# EAGLE schematic dash (EAGLE 9.6.2)

## Sheet 1 of 2
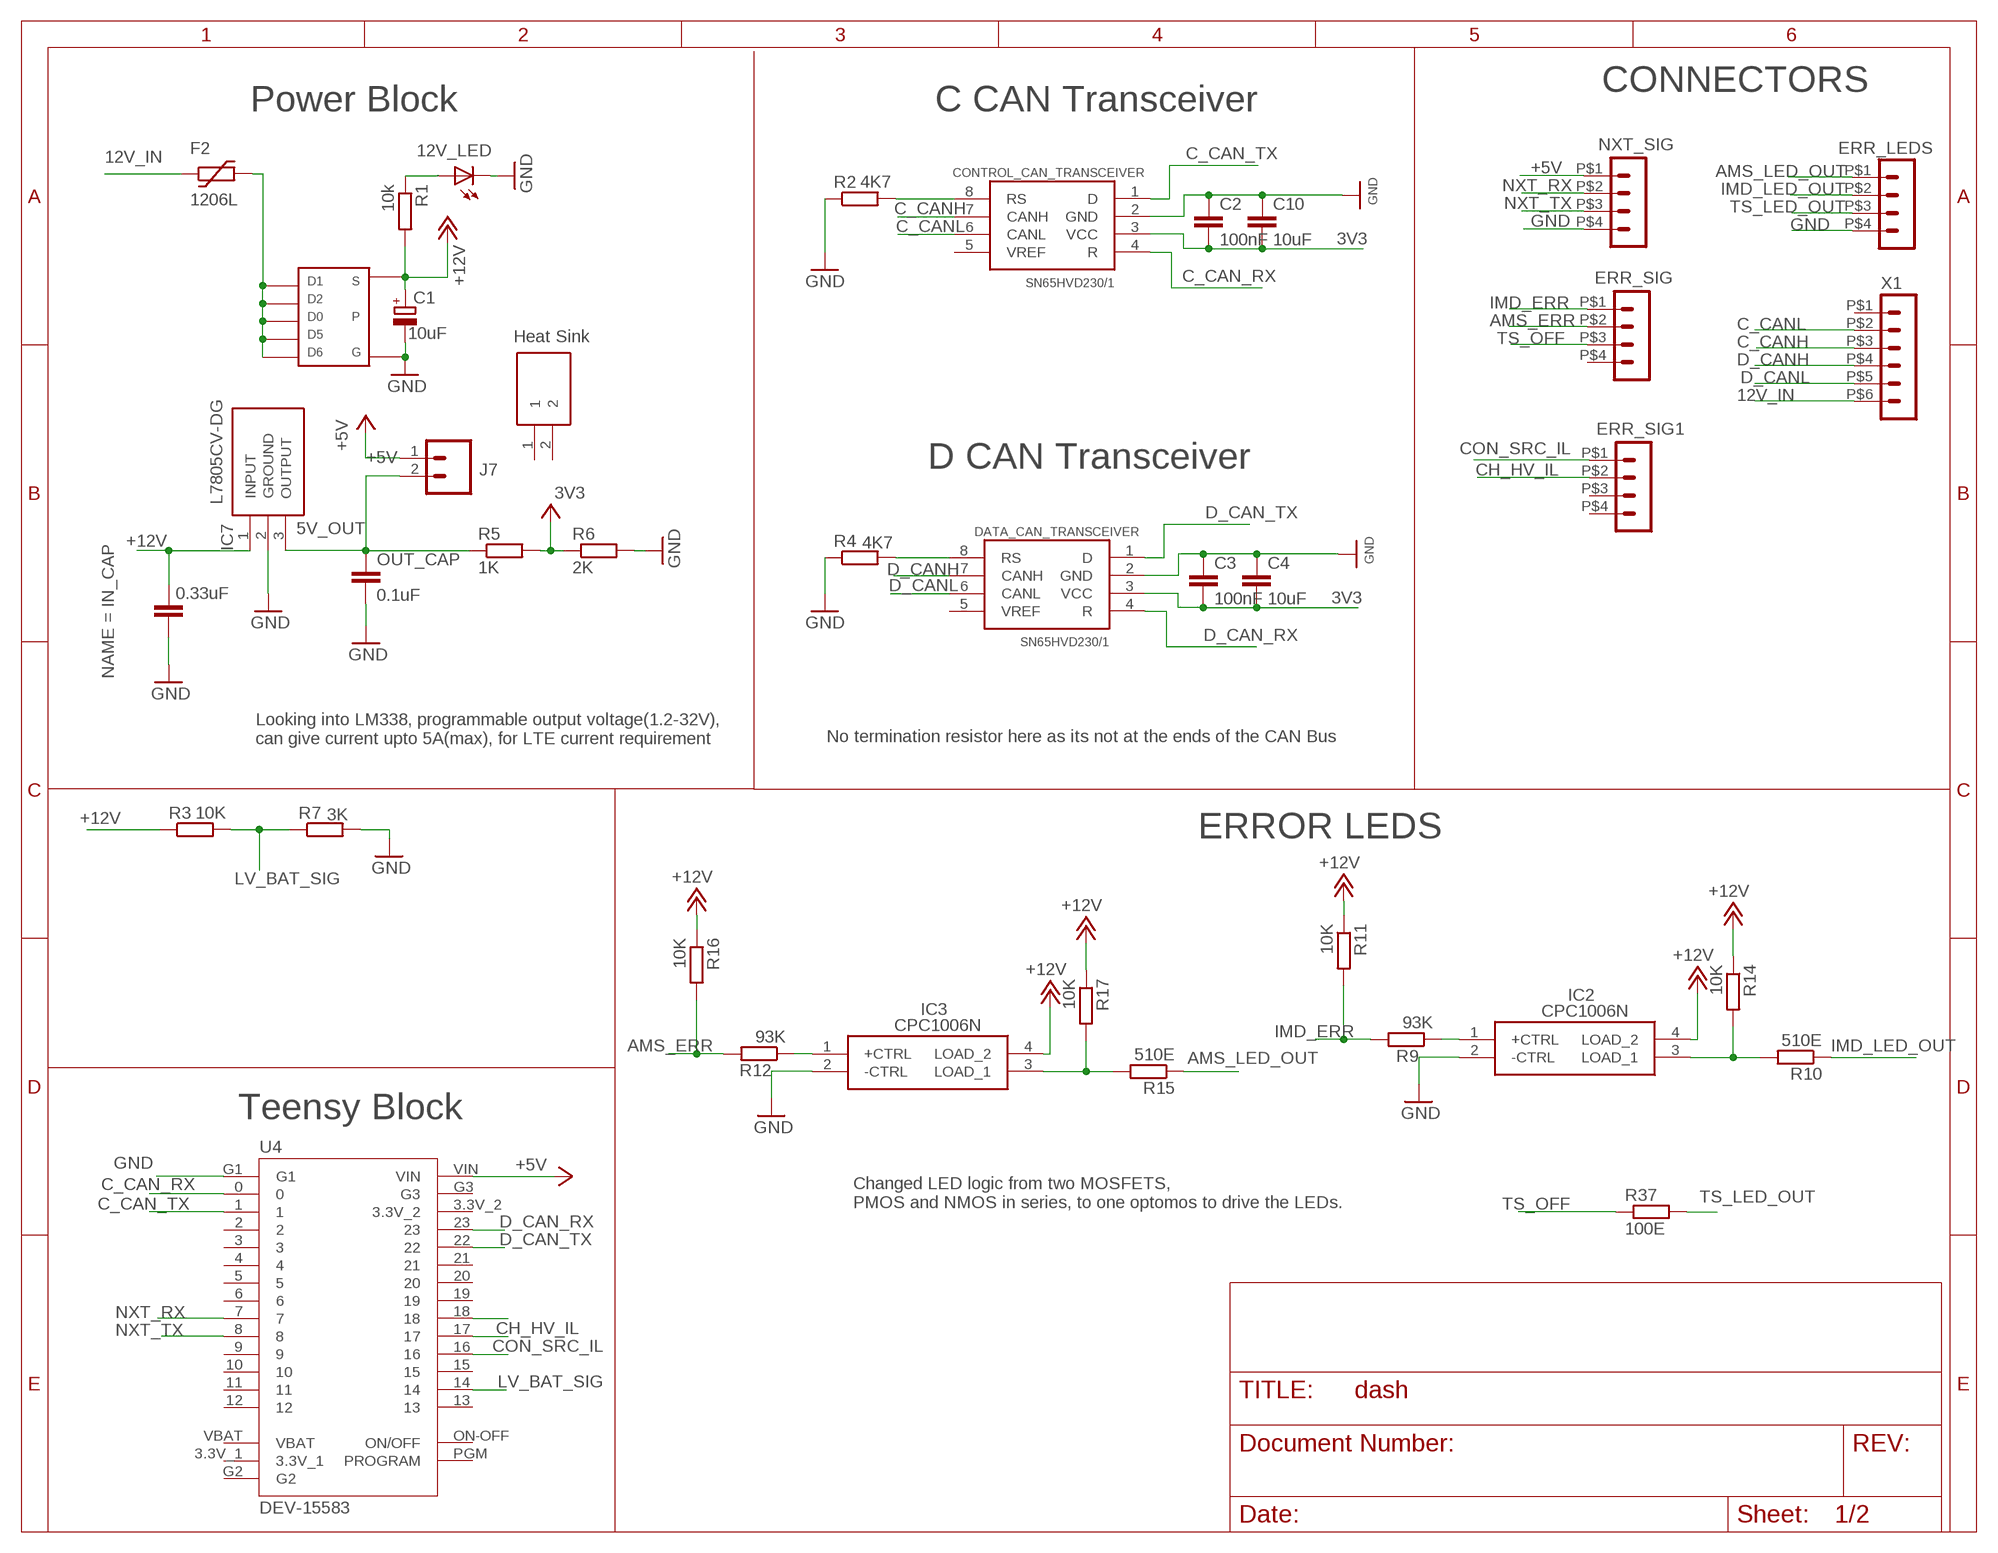
[diagram p0: schematic, sheet 1]

### Parts
12V_LED  LED1206  [LED-1206]
C1  10uF  CPOL-EUE2.5-6  [E2,5-6]
C2  100nF  C-EUC0805  [C0805]
C3  100nF  C-EUC0805  [C0805]
C4  10uF  C-EUC0805  [C0805]
C10  10uF  C-EUC0805  [C0805]
CONTROL_CAN_TRANSCEIVER  SN65HVD230/1  [SO8]
DATA_CAN_TRANSCEIVER  SN65HVD230/1  [SO8]
ERR_LEDS  HEADER_POS4_43045-0412  [43045-0412]
ERR_SIG  HEADER_POS4_43045-0412  [43045-0412]
ERR_SIG1  HEADER_POS4_43045-0412  [43045-0412]
F2  1206L  [1206L]
IC2  CPC1006N  [SOP254P610X216-4N]
IC3  CPC1006N  [SOP254P610X216-4N]
IC7  L7805CV-DG  [TO255P460X1020X2008-3P]
IN_CAP  0.33uF  C-EUC0805  [C0805]
J7  CONN_02  [1X02]
NXT_SIG  HEADER_POS4_43045-0412  [43045-0412]
OUT_CAP  0.1uF  C-EUC0805  [C0805]
R1  10k  R-EU_R0805  [R0805]
R2  4K7  R-EU_R0805  [R0805]
R3  10K  R-EU_R0805  [R0805]
R4  4K7  R-EU_R0805  [R0805]
R5  1K  R-EU_R0805  [R0805]
R6  2K  R-EU_R0805  [R0805]
R7  3K  R-EU_R0805  [R0805]
R9  93K  R-EU_R0805  [R0805]
R10  510E  R-EU_R0805  [R0805]
R11  10K  R-EU_R0805  [R0805]
R12  93K  R-EU_R0805  [R0805]
R14  10K  R-EU_R0805  [R0805]
R15  510E  R-EU_R0805  [R0805]
R16  10K  R-EU_R0805  [R0805]
R17  10K  R-EU_R0805  [R0805]
R37  100E  R-EU_R0805  [R0805]
U3  HSS10-B20-P40  [HSS10B20P40]
U4  DEV-15583  [MODULE_DEV-15583]
U$2  TSOP-6_PMOS  [TSOP-6_PMOS]
X1  HEADER_POS6_43045-0612  [43045-0612]

### Nets
3V3: C2.2 C3.2 C4.2 C10.2 CONTROL_CAN_TRANSCEIVER.3(VCC) DATA_CAN_TRANSCEIVER.3(VCC) R5.2 R6.1 ; supply symbol labelled +3V3
5V_OUT: IC7.3(OUTPUT) J7.2 OUT_CAP.1 R5.1
12V_IN: F2.P$1 X1.P$6
+5V: J7.1 NXT_SIG.P$1 U4.VIN
+12V: C1.+ IC2.4(LOAD_2) IC3.4(LOAD_2) IC7.1(INPUT) IN_CAP.1 R1.2 R3.1 R11.1 R14.1 R16.1 R17.1 U$2.S
AMS_ERR: ERR_SIG.P$2 R12.2 R16.2
AMS_ERR_INV: IC2.2(-CTRL) IC3.2(-CTRL) ; supply symbol labelled GND
AMS_LED_OUT: ERR_LEDS.P$1 R15.1
C_CAN_RX: CONTROL_CAN_TRANSCEIVER.4(R) U4.0
C_CAN_TX: CONTROL_CAN_TRANSCEIVER.1(D) U4.1
C_CANH: CONTROL_CAN_TRANSCEIVER.7(CANH) X1.P$3
C_CANL: CONTROL_CAN_TRANSCEIVER.6(CANL) X1.P$2
CH_HV_IL: ERR_SIG1.P$2 U4.17
CON_SRC_IL: ERR_SIG1.P$1 U4.16
D_CAN_RX: DATA_CAN_TRANSCEIVER.4(R) U4.23
D_CAN_TX: DATA_CAN_TRANSCEIVER.1(D) U4.22
D_CANH: DATA_CAN_TRANSCEIVER.7(CANH) X1.P$4
D_CANL: DATA_CAN_TRANSCEIVER.6(CANL) X1.P$5
GND: 12V_LED.C C1.- C2.1 C3.1 C4.1 C10.1 CONTROL_CAN_TRANSCEIVER.2(GND) DATA_CAN_TRANSCEIVER.2(GND) ERR_LEDS.P$4 IC7.2(GROUND) IN_CAP.2 NXT_SIG.P$4 OUT_CAP.2 R2.1 R4.1 R6.2 R7.2 U4.G1 U$2.G
I2C_SDA: U4.18
IMD_ERR: ERR_SIG.P$1 R9.2 R11.2
IMD_LED_OUT: ERR_LEDS.P$2 R10.1
LV_BAT_SIG: R3.2 R7.1 U4.14
N$2: DATA_CAN_TRANSCEIVER.8(RS) R4.2
N$3: IC2.1(+CTRL) R9.1
N$4: IC3.1(+CTRL) R12.1
N$5: CONTROL_CAN_TRANSCEIVER.8(RS) R2.2
N$7: IC3.3(LOAD_1) R15.2 R17.2
N$9: F2.P$2 U$2.1 U$2.2 U$2.5 U$2.6 U$2.D(D0)
N$10: IC2.3(LOAD_1) R10.2 R14.2
N$15: 12V_LED.A R1.1
NXT_RX: NXT_SIG.P$2 U4.7
NXT_TX: NXT_SIG.P$3 U4.8
TS_LED_OUT: ERR_LEDS.P$3 R37.2
TS_OFF: ERR_SIG.P$3 R37.1
Unconnected: CONTROL_CAN_TRANSCEIVER.5(VREF) DATA_CAN_TRANSCEIVER.5(VREF) ERR_SIG1.P$3 ERR_SIG1.P$4 ERR_SIG.P$4 U3.1 U3.2 U4.2 U4.3 U4.4 U4.5 U4.6 U4.9 U4.10 U4.11 U4.12 U4.13 U4.15 U4.19 U4.20 U4.21 U4.ON-OFF(ON/OFF) U4.PGM(PROGRAM) X1.P$1

### Notes on the sheet
- CONNECTORS
- Power Block | C CAN Transceiver
- Heat Sink
- D CAN Transceiver
- No termination resistor here as its not at the ends of the CAN Bus
- Looking into LM338, programmable output voltage(1.2-32V), 
  can give current upto 5A(max), for LTE current requirement
- ERROR LEDS
- Teensy Block
- Changed LED logic from two MOSFETS,
  PMOS and NMOS in series, to one optomos to drive the LEDs.

## Sheet 2 of 2

## Power pins joined to a net without a drawn wire
3.3V_1: U4.3.3V_1
3.3V_2: U4.3.3V_2
G2: U4.G2
G3: U4.G3
VBAT: U4.VBAT

## Library data of the parts
12V_LED = SparkFun-LED:LED: LEDs Standard schematic elements and footprints for 5mm, 3mm, 1206, and 0603 sized LEDs. 5mm - Spark Fun Electronics SKU : COM-00529 (and others)
C1 = IIT_BOMBAY_Racing:CPOL-EU: POLARIZED CAPACITOR, European symbol
C2-C4 C10 IN_CAP OUT_CAP = IIT_BOMBAY_Racing:C-EU: CAPACITOR, European symbol
CONTROL_CAN_TRANSCEIVER DATA_CAN_TRANSCEIVER = texas_1:SN65HVD230/1
ERR_LEDS ERR_SIG ERR_SIG1 NXT_SIG = IIT_BOMBAY_Racing:HEADER_POS4_?: Molex - Micro-Fit 3.0 Series connector, 3.00mm (0.118") pitch header, 4 positions.
F2 = IIT_BOMBAY_Racing:1206L
IC2 IC3 = CPC1006N:CPC1006N: SPST-NO Solid State Relay Solder 75 mA rms/mA dc Surface Mount, DC MOSFET Source: Datasheet <https://componentsearchengine.com/Datasheets/1/CPC1006N.pdf>; DESCRIPTION: SPST-NO Solid State Relay Solder 75 mA rms/mA dc Surface Mount, DC MOSFET; HEIGHT: 2.159mm; MANUFACTURER_NAME: LITTELFUSE; MANUFACTURER_PART_NUMBER: CPC1006N; MOUSER_PART_NUMBER: 849-CPC1006N; MOUSER_PRICE-STOCK: https://www.mouser.co.uk/ProductDetail/IXYS-Integrated-Circuits/CPC1006N?qs=8uBHJDVwVqwpldvM8lkCRw%3D%3D
IC7 = SamacSys_Parts:L7805CV-DG: Voltage Regulator 5V 4% 1.5A TO220 L7805CV-DG, Linear Voltage Regulator, Current Limit, Shut-Down 1.5A 5 V, 3-Pin TO220 Source: Datasheet <http://www.st.com/web/en/resource/technical/document/datasheet/CD00000444.pdf>; DESCRIPTION: Voltage Regulator 5V 4% 1.5A TO220 L7805CV-DG, Linear Voltage Regulator, Current Limit, Shut-Down 1.5A 5 V, 3-Pin TO220; HEIGHT: 4.6mm; MANUFACTURER_NAME: STMicroelectronics; MANUFACTURER_PART_NUMBER: L7805CV-DG; MOUSER_PART_NUMBER: 511-L7805CV-DG; MOUSER_PRICE-STOCK: https://www.mouser.co.uk/ProductDetail/STMicroelectronics/L7805CV-DG?qs=T%2FOtf55vL7c3O0as9P9fAw%3D%3D
J7 = SparkFun-Connectors:CONN_02: Multi connection point. Often used as Generic Header-pin footprint for 0.1 inch spaced/style header connections On any of the 0.1 inch spaced packages, you can populate with these: Break Away Headers - Straight <https://www.sparkfun.com/products/116> (PRT-00116) Break Away Male Headers - Right Angle <https://www.sparkfun.com/products/553> (PRT-00553) Female Headers <https://www.sparkfun.com/products/115> (PRT-00115) Break Away Headers - Machine Pin <https://www.sparkfun.com/products/117> (PRT-00117) Break Away Female Headers - Swiss Machine Pin <https://www.sparkfun.com/products/743> (PRT-00743) For SCREWTERMINALS and SPRING TERMINALS visit here: Screw Terimnals on SparkFun.com <https://www.sparkfun.com/search/results?term=Screw+Terminals> (5mm/3.5mm/2.54mm spacing) This device is also useful as a general connection point to wire up your design to another part of your project. Our various solder wires solder well into these plated through hole pads. Hook-Up Wire - Assortment (Stranded, 22 AWG) <https://www.sparkfun.com/products/11375> (PRT-11375) Hook-Up Wire - Assortment (Solid Core, 22 AWG) <https://www.sparkfun.com/products/11367> (PRT-11367) View the entire wire category on our website here <https://www.sparkfun.com/categories/141> Special notes: Molex polarized connector foot print use with: PRT-08233 with associated crimp pins and housings. 2.54_SCREWTERM for use with PRT-10571. 3.5mm Screw Terminal footprints for PRT-08084 5mm Screw Terminal footprints for use with PRT-08432
R1-R7 R9-R12 R14-R17 R37 = IIT_BOMBAY_Racing:R-EU_: RESISTOR, European symbol
U3 = HSS10-B20-P40:HSS10-B20-P40: Heat Sinks heat sink, stamping, TO-220, 29.97 x 25. Source: Datasheet <https://www.cuidevices.com/product/resource/hss10-b20-p40.pdf>; DESCRIPTION: Heat Sinks heat sink, stamping, TO-220, 29.97 x 25.; HEIGHT: 29.97mm; MANUFACTURER_NAME: CUI Inc.; MANUFACTURER_PART_NUMBER: HSS10-B20-P40; MOUSER_PART_NUMBER: 490-HSS10-B20-P40; MOUSER_PRICE-STOCK: https://www.mouser.co.uk/ProductDetail/CUI-Devices/HSS10-B20-P40?qs=QNEnbhJQKvYYvwy4FCjq1A%3D%3D
U4 = DEV-15583:DEV-15583: RT1062 Teensy 4.0 i.MX ARM® Cortex®-M7 MPU Embedded Evaluation Board Check availability <https://pricing.snapeda.com/parts/DEV-15583/SparkFun%20Electronics/view-part?ref=eda>; AVAILABILITY: In Stock; DESCRIPTION: RT1062 Teensy 4.0 series ARM® Cortex®-M7 MPU Embedded Evaluation Board; MF: SparkFun Electronics; MP: DEV-15583; PACKAGE: None; PRICE: None; PURCHASE-URL: https://pricing.snapeda.com/search/part/DEV-15583/?ref=eda
U$2 = TSOP-6_MOS:TSOP-6_PMOS
X1 = IIT_BOMBAY_Racing:HEADER_POS6_?: Molex - Micro-Fit 3.0 Series connector, 3.00mm (0.118") pitch header, 6 positions.